# EAGLE design Digital Output Board (EAGLE 7.6.0)
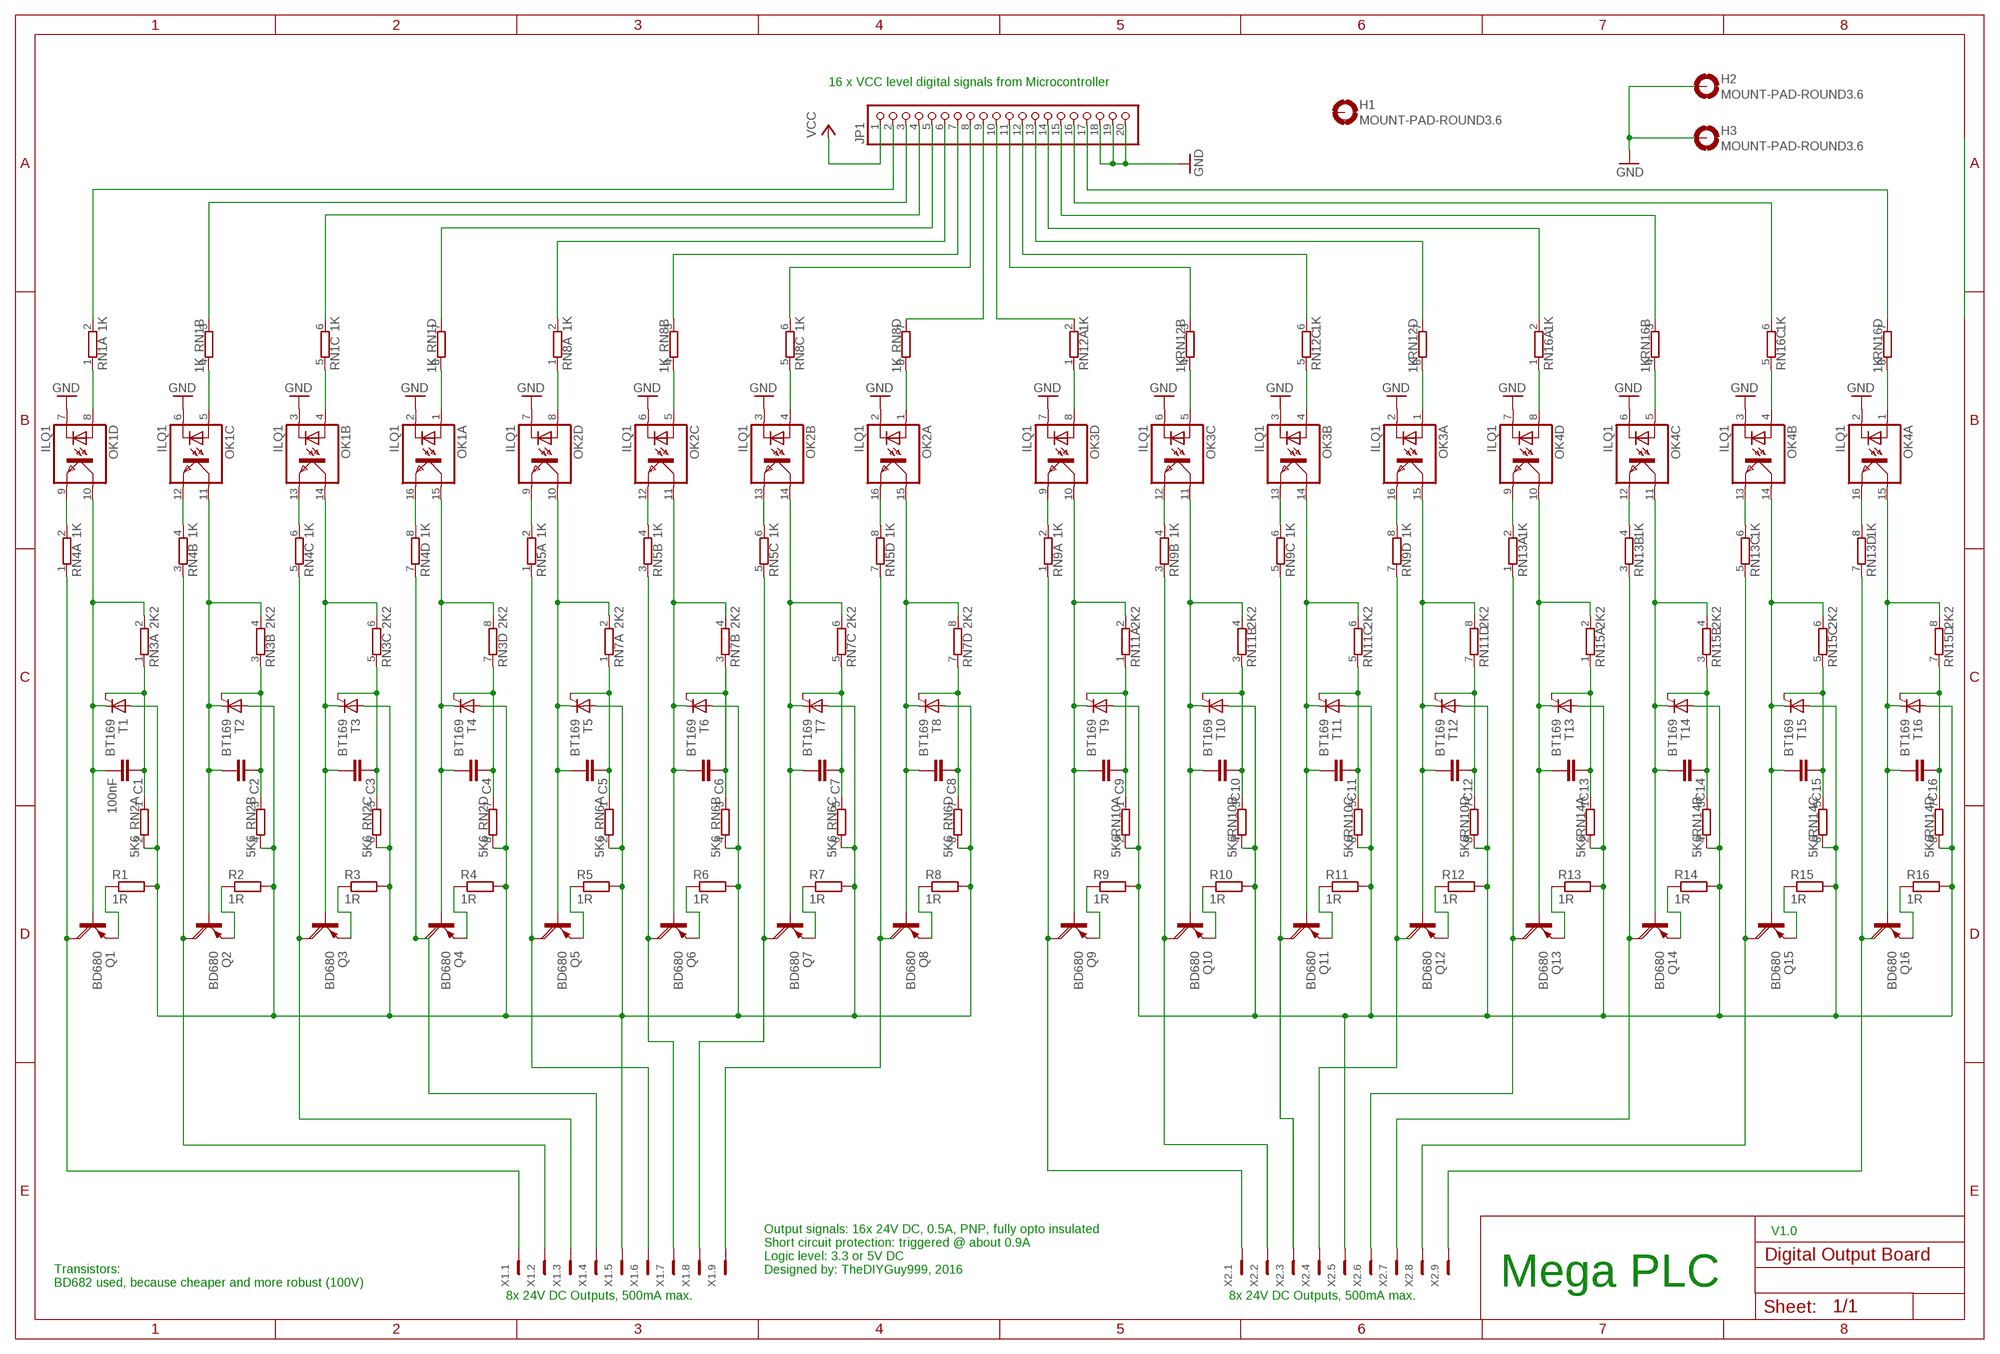
[diagram p0: schematic, sheet 1]

## Parts
C1  100nF  C-EU025-024X044  [C025-024X044]
C2  C-EU025-024X044  [C025-024X044]
C3  C-EU025-024X044  [C025-024X044]
C4  C-EU025-024X044  [C025-024X044]
C5  C-EU025-024X044  [C025-024X044]
C6  C-EU025-024X044  [C025-024X044]
C7  C-EU025-024X044  [C025-024X044]
C8  C-EU025-024X044  [C025-024X044]
C9  C-EU025-024X044  [C025-024X044]
C10  C-EU025-024X044  [C025-024X044]
C11  C-EU025-024X044  [C025-024X044]
C12  C-EU025-024X044  [C025-024X044]
C13  C-EU025-024X044  [C025-024X044]
C14  C-EU025-024X044  [C025-024X044]
C15  C-EU025-024X044  [C025-024X044]
C16  C-EU025-024X044  [C025-024X044]
H1  MOUNT-PAD-ROUND3.6  [3,6-PAD]
H2  MOUNT-PAD-ROUND3.6  [3,6-PAD]
H3  MOUNT-PAD-ROUND3.6  [3,6-PAD]
JP1  PINHD-1X20/90  [1X20/90]
OK1  ILQ1  [DIL16]
OK2  ILQ1  [DIL16]
OK3  ILQ1  [DIL16]
OK4  ILQ1  [DIL16]
Q1  BD680  [TO126AV]
Q2  BD680  [TO126AV]
Q3  BD680  [TO126AV]
Q4  BD680  [TO126AV]
Q5  BD680  [TO126AV]
Q6  BD680  [TO126AV]
Q7  BD680  [TO126AV]
Q8  BD680  [TO126AV]
Q9  BD680  [TO126AV]
Q10  BD680  [TO126AV]
Q11  BD680  [TO126AV]
Q12  BD680  [TO126AV]
Q13  BD680  [TO126AV]
Q14  BD680  [TO126AV]
Q15  BD680  [TO126AV]
Q16  BD680  [TO126AV]
R1  1R  R-EU_0207/10  [0207/10]
R2  1R  R-EU_0207/10  [0207/10]
R3  1R  R-EU_0207/10  [0207/10]
R4  1R  R-EU_0207/10  [0207/10]
R5  1R  R-EU_0207/10  [0207/10]
R6  1R  R-EU_0207/10  [0207/10]
R7  1R  R-EU_0207/10  [0207/10]
R8  1R  R-EU_0207/10  [0207/10]
R9  1R  R-EU_0207/10  [0207/10]
R10  1R  R-EU_0207/10  [0207/10]
R11  1R  R-EU_0207/10  [0207/10]
R12  1R  R-EU_0207/10  [0207/10]
R13  1R  R-EU_0207/10  [0207/10]
R14  1R  R-EU_0207/10  [0207/10]
R15  1R  R-EU_0207/10  [0207/10]
R16  1R  R-EU_0207/10  [0207/10]
RN1  1K  E4R  [SIL8]
RN2  5K6  E4R  [SIL8]
RN3  2K2  E4R  [SIL8]
RN4  1K  E4R  [SIL8]
RN5  1K  E4R  [SIL8]
RN6  5K6  E4R  [SIL8]
RN7  2K2  E4R  [SIL8]
RN8  1K  E4R  [SIL8]
RN9  1K  E4R  [SIL8]
RN10  5K6  E4R  [SIL8]
RN11  2K2  E4R  [SIL8]
RN12  1K  E4R  [SIL8]
RN13  1K  E4R  [SIL8]
RN14  5K6  E4R  [SIL8]
RN15  2K2  E4R  [SIL8]
RN16  1K  E4R  [SIL8]
T1  BT169  [TO92-2]
T2  BT169  [TO92-2]
T3  BT169  [TO92-2]
T4  BT169  [TO92-2]
T5  BT169  [TO92-2]
T6  BT169  [TO92-2]
T7  BT169  [TO92-2]
T8  BT169  [TO92-2]
T9  BT169  [TO92-2]
T10  BT169  [TO92-2]
T11  BT169  [TO92-2]
T12  BT169  [TO92-2]
T13  BT169  [TO92-2]
T14  BT169  [TO92-2]
T15  BT169  [TO92-2]
T16  BT169  [TO92-2]
X1  MC9  [MC9]
X2  MC9  [MC9]

## Nets
C+1 [24V]: R1.2 R2.2 R3.2 R4.2 R5.2 R6.2 R7.2 R8.2 RN2.2 RN2.4 RN2.6 RN2.8 RN6.2 RN6.4 RN6.6 RN6.8 T1.A T2.A T3.A T4.A T5.A T6.A T7.A T8.A X1.5
C+2 [24V]: R9.2 R10.2 R11.2 R12.2 R13.2 R14.2 R15.2 R16.2 RN10.2 RN10.4 RN10.6 RN10.8 RN14.2 RN14.4 RN14.6 RN14.8 T9.A T10.A T11.A T12.A T13.A T14.A T15.A T16.A X2.5
GND: H2.B3,6(MOUNT) H3.B3,6(MOUNT) JP1.18 JP1.19 JP1.20 OK1.2(A:C) OK1.3(B:C) OK1.6(C:C) OK1.7(D:C) OK2.2(A:C) OK2.3(B:C) OK2.6(C:C) OK2.7(D:C) OK3.2(A:C) OK3.3(B:C) OK3.6(C:C) OK3.7(D:C) OK4.2(A:C) OK4.3(B:C) OK4.6(C:C) OK4.7(D:C)
N$1: Q1.E R1.1
N$2: OK1.8(D:A) RN1.1
N$3: OK1.5(C:A) RN1.4
N$4: OK1.4(B:A) RN1.5
N$5: OK1.1(A:A) RN1.8
N$6: JP1.2 RN1.2
N$7: JP1.3 RN1.3
N$8: JP1.4 RN1.6
N$9: JP1.5 RN1.7
N$10: OK1.9(D:EMIT) RN4.2
N$11: OK1.12(C:EMIT) RN4.4
N$12: OK1.13(B:EMIT) RN4.6
N$13: OK1.16(A:EMIT) RN4.8
N$14: C1.2 OK1.10(D:COL) Q1.B RN3.2 T1.C
N$15: C1.1 RN2.1 RN3.1 T1.G
N$16: Q1.C RN4.1 X1.1
N$17: Q2.C RN4.3 X1.2
N$18: Q3.C RN4.5 X1.3
N$19: Q4.C RN4.7 X1.4
N$20: C2.2 OK1.11(C:COL) Q2.B RN3.4 T2.C
N$21: C3.2 OK1.14(B:COL) Q3.B RN3.6 T3.C
N$22: C4.2 OK1.15(A:COL) Q4.B RN3.8 T4.C
N$23: Q2.E R2.1
N$24: Q3.E R3.1
N$25: Q4.E R4.1
N$26: C2.1 RN2.3 RN3.3 T2.G
N$27: C3.1 RN2.5 RN3.5 T3.G
N$28: C4.1 RN2.7 RN3.7 T4.G
N$29: JP1.6 RN8.2
N$30: JP1.7 RN8.3
N$31: JP1.8 RN8.6
N$32: JP1.9 RN8.7
N$33: OK2.8(D:A) RN8.1
N$34: OK2.4(B:A) RN8.5
N$35: OK2.5(C:A) RN8.4
N$36: OK2.1(A:A) RN8.8
N$37: OK2.9(D:EMIT) RN5.2
N$38: OK2.12(C:EMIT) RN5.4
N$39: OK2.13(B:EMIT) RN5.6
N$40: OK2.16(A:EMIT) RN5.8
N$41: C5.1 RN6.1 RN7.1 T5.G
N$42: Q5.E R5.1
N$43: C5.2 OK2.10(D:COL) Q5.B RN7.2 T5.C
N$44: Q5.C RN5.1 X1.6
N$45: Q6.C RN5.3 X1.7
N$46: Q7.C RN5.5 X1.8
N$47: Q8.C RN5.7 X1.9
N$48: C6.2 OK2.11(C:COL) Q6.B RN7.4 T6.C
N$49: C7.2 OK2.14(B:COL) Q7.B RN7.6 T7.C
N$50: C8.2 OK2.15(A:COL) Q8.B RN7.8 T8.C
N$51: Q6.E R6.1
N$52: Q7.E R7.1
N$53: Q8.E R8.1
N$54: C6.1 RN6.3 RN7.3 T6.G
N$55: C7.1 RN6.5 RN7.5 T7.G
N$56: C8.1 RN6.7 RN7.7 T8.G
N$61: OK3.8(D:A) RN12.1
N$62: OK3.4(B:A) RN12.5
N$63: OK3.5(C:A) RN12.4
N$64: OK3.1(A:A) RN12.8
N$65: OK3.9(D:EMIT) RN9.2
N$66: OK3.12(C:EMIT) RN9.4
N$67: OK3.13(B:EMIT) RN9.6
N$68: OK3.16(A:EMIT) RN9.8
N$69: C9.1 RN10.1 RN11.1 T9.G
N$70: Q9.E R9.1
N$71: C9.2 OK3.10(D:COL) Q9.B RN11.2 T9.C
N$72: Q9.C RN9.1 X2.1
N$73: Q10.C RN9.3 X2.2
N$74: Q11.C RN9.5 X2.3
N$75: Q12.C RN9.7 X2.4
N$76: C10.2 OK3.11(C:COL) Q10.B RN11.4 T10.C
N$77: C11.2 OK3.14(B:COL) Q11.B RN11.6 T11.C
N$78: C12.2 OK3.15(A:COL) Q12.B RN11.8 T12.C
N$79: Q10.E R10.1
N$80: Q11.E R11.1
N$81: Q12.E R12.1
N$82: C10.1 RN10.3 RN11.3 T10.G
N$83: C11.1 RN10.5 RN11.5 T11.G
N$84: C12.1 RN10.7 RN11.7 T12.G
N$85: OK4.8(D:A) RN16.1
N$86: OK4.4(B:A) RN16.5
N$87: OK4.5(C:A) RN16.4
N$88: OK4.1(A:A) RN16.8
N$89: OK4.9(D:EMIT) RN13.2
N$90: OK4.12(C:EMIT) RN13.4
N$91: OK4.13(B:EMIT) RN13.6
N$92: OK4.16(A:EMIT) RN13.8
N$93: C13.1 RN14.1 RN15.1 T13.G
N$94: Q13.E R13.1
N$95: C13.2 OK4.10(D:COL) Q13.B RN15.2 T13.C
N$96: Q13.C RN13.1 X2.6
N$97: Q14.C RN13.3 X2.7
N$98: Q15.C RN13.5 X2.8
N$99: Q16.C RN13.7 X2.9
N$100: C14.2 OK4.11(C:COL) Q14.B RN15.4 T14.C
N$101: C15.2 OK4.14(B:COL) Q15.B RN15.6 T15.C
N$102: C16.2 OK4.15(A:COL) Q16.B RN15.8 T16.C
N$103: Q14.E R14.1
N$104: Q15.E R15.1
N$105: Q16.E R16.1
N$106: C14.1 RN14.3 RN15.3 T14.G
N$107: C15.1 RN14.5 RN15.5 T15.G
N$108: C16.1 RN14.7 RN15.7 T16.G
N$109: JP1.10 RN12.2
N$110: JP1.17 RN16.7
N$111: JP1.16 RN16.6
N$113: JP1.15 RN16.3
N$114: JP1.14 RN16.2
N$115: JP1.13 RN12.7
N$116: JP1.12 RN12.6
N$117: JP1.11 RN12.3
VCC: JP1.1
Unconnected: H1.B3,6(MOUNT)

## Notes on the sheet
- 16 x VCC level digital signals from Microcontroller
- V1.0
- Output signals: 16x 24V DC, 0.5A, PNP, fully opto insulated
  Short circuit protection: triggered @ about 0.9A
  Logic level: 3.3 or 5V DC
  Designed by: TheDIYGuy999, 2016
- Transistors:
  BD682 used, because cheaper and more robust (100V)
- Mega PLC
- 8x 24V DC Outputs, 500mA max. | 8x 24V DC Outputs, 500mA max.

## Library data of the parts
C1-C16 = rcl:C-EU: CAPACITOR, European symbol
H1-H3 = holes:MOUNT-PAD-ROUND: MOUNTING PAD, round
JP1 = pinhead:PINHD-1X20: PIN HEADER
OK1-OK4 = optocoupler:ILQ1: SIEMENS OPTO COUPLER; MF: VISHAY/TELEFUNKEN; MPN: ILQ1; OC_FARNELL: 1469501; OC_NEWARK: 88K1954
Q1-Q16 = 00_transistor-power:BD680: PNP DARLINGTON TRANSISTOR
R1-R16 = rcl:R-EU_: RESISTOR, European symbol
RN1-RN16 = resistor-sil:E4R: SIL RESISTOR; OC_FARNELL: unknown; OC_NEWARK: unknown
T1-T16 = triac:BT169: THYRISTOR
X1 X2 = 00_con-phoenix-381_l:MC9: Mini-Combicon 3.81mm horizontal 9-polig MC 1,5/9-G-3,81 Artikel-Nr. 1803345

## Net classes
1 24V: clearance 0.254 mm

## Board
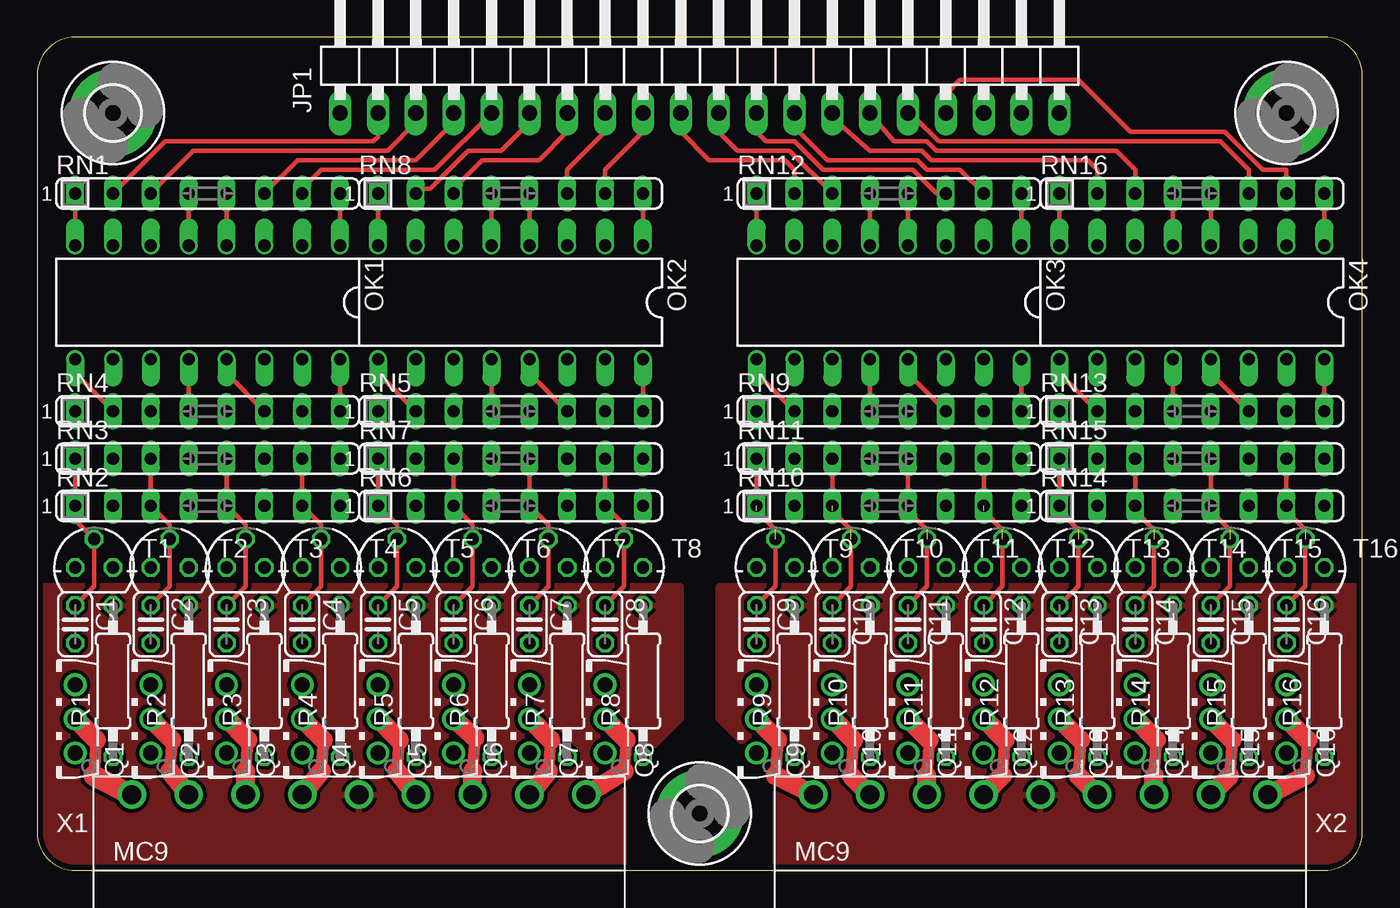
[diagram p1: board, top side]
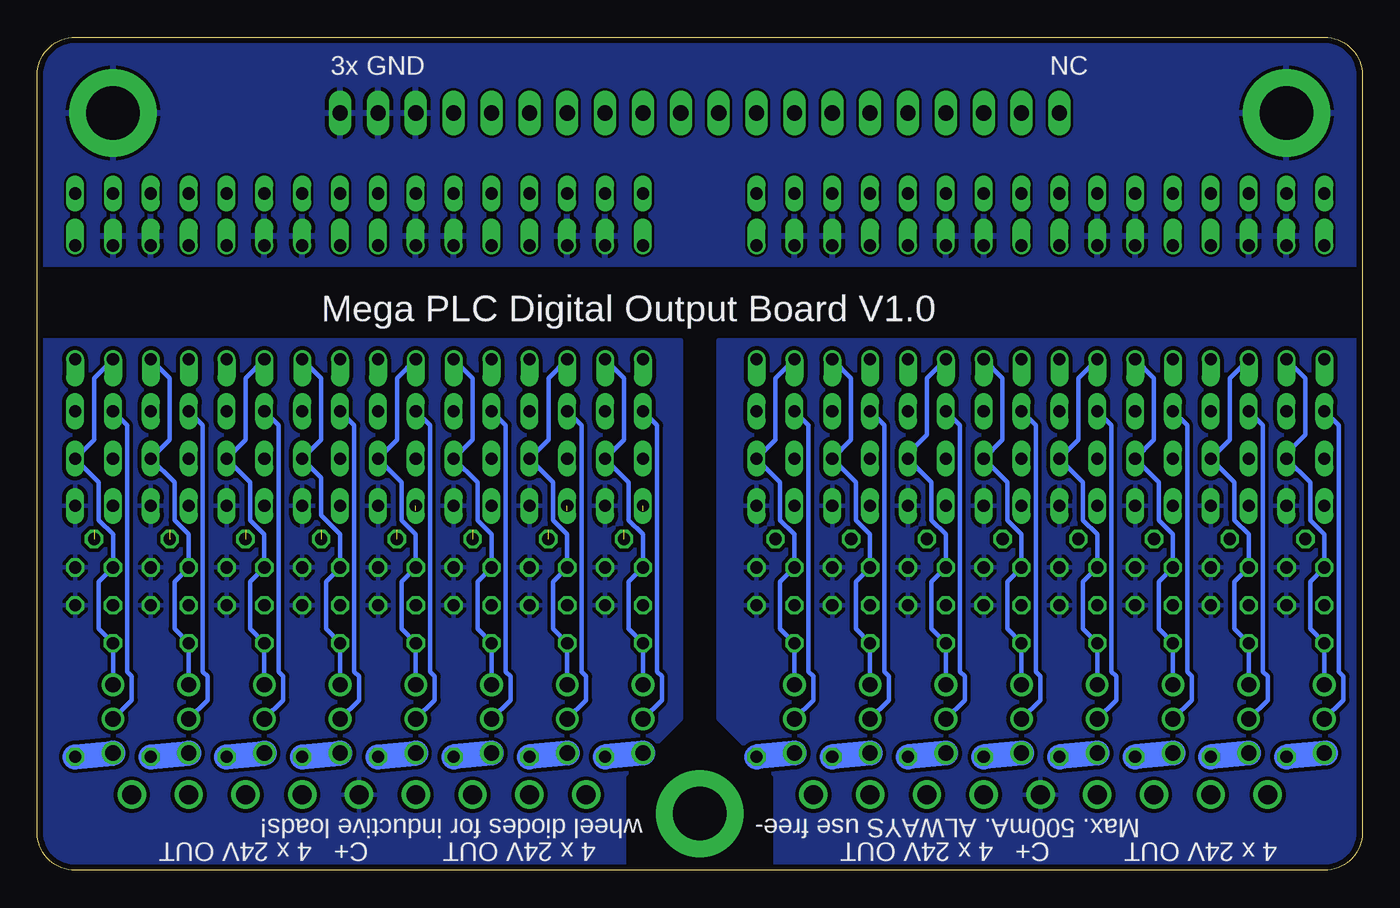
[diagram p2: board, bottom side, seen from below]

Size 88.9 x 55.88 mm. Coordinates in mm from the lower left corner, seen from the top.
Outline: 0,53.34 0,2.54 arc90 2.54,0 86.36,0 arc90 88.9,2.54 88.9,53.34 arc90 86.36,55.88 2.54,55.88 arc90 0,53.34
Copper layers (1*16): Top 0.0356mm / dielectric 1.5011mm / Bottom 0.0356mm
Design rules "OSHPark_LaenPCBOrder": minimum track width 6mil, minimum drill 13mil, track to track 6mil, track to pad 6mil, pad to pad 6mil, via to via 6mil, smd to smd 6mil, copper to edge 15mil, drill to drill 6mil, minimum pad ring 7mil, minimum via ring 7mil, stop-mask expansion 3mil, vias tented up to drill 0mil, thermal gap 10mil

### Footprints (pad centres in the part's own frame; a part is rotated, then mirrored left to right if it is on the bottom)
C025-024X044 = drill 0.813 octagon: 1 -1.27,0; 2 1.27,0
3,6-PAD = drill 3.6 pad 5.842: B3,6 0,0
1X20/90 = drill 1.016 long: 1 -24.13,-3.81; 2 -21.59,-3.81; 3 -19.05,-3.81; 4 -16.51,-3.81; 5 -13.97,-3.81; 6 -11.43,-3.81; 7 -8.89,-3.81; 8 -6.35,-3.81; 9 -3.81,-3.81; 10 -1.27,-3.81; 11 1.27,-3.81; 12 3.81,-3.81; 13 6.35,-3.81; 14 8.89,-3.81; 15 11.43,-3.81; 16 13.97,-3.81; 17 16.51,-3.81; 18 19.05,-3.81; 19 21.59,-3.81; 20 24.13,-3.81
DIL16 = drill 0.813 offset: 1 -8.89,-3.81; 2 -6.35,-3.81; 3 -3.81,-3.81; 4 -1.27,-3.81; 5 1.27,-3.81; 6 3.81,-3.81; 7 6.35,-3.81; 8 8.89,-3.81; 9 8.89,3.81; 10 6.35,3.81; 11 3.81,3.81; 12 1.27,3.81; 13 -1.27,3.81; 14 -3.81,3.81; 15 -6.35,3.81; 16 -8.89,3.81
TO126AV = drill 1.016: B 2.286,-1.27; C 0,-1.27; E -2.286,-1.27
0207/10 = drill 0.813 octagon: 1 -5.08,0; 2 5.08,0
SIL8 = drill 0.813 long: 1 -8.89,0; 2 -6.35,0; 3 -3.81,0; 4 -1.27,0; 5 1.27,0; 6 3.81,0; 7 6.35,0; 8 8.89,0
TO92-2 = drill 0.813 octagon: A 1.27,0; C -1.27,0; G 0,1.905
MC9 = drill 1.27: 1 -15.24,0; 2 -11.43,0; 3 -7.62,0; 4 -3.81,0; 5 0,0; 6 3.81,0; 7 7.62,0; 8 11.43,0; 9 15.24,0

### Placement (x,y rotation side)
C1  2.54,16.51 270 top
C2  7.62,16.51 270 top
C3  12.7,16.51 270 top
C4  17.78,16.51 270 top
C5  22.86,16.51 270 top
C6  27.94,16.51 270 top
C7  33.02,16.51 270 top
C8  38.1,16.51 270 top
C9  48.26,16.51 270 top
C10  53.34,16.51 270 top
C11  58.42,16.51 270 top
C12  63.5,16.51 270 top
C13  68.58,16.51 270 top
C14  73.66,16.51 270 top
C15  78.74,16.51 270 top
C16  83.82,16.51 270 top
H1  44.45,3.81 0 top
H2  5.08,50.8 0 top
H3  83.82,50.8 0 top
JP1  44.45,54.61 0 top
OK1  11.43,38.1 180 top
OK2  31.75,38.1 180 top
OK3  57.15,38.1 180 top
OK4  77.47,38.1 180 top
Q1  1.27,10.16 90 top
Q2  6.35,10.16 90 top
Q3  11.43,10.16 90 top
Q4  16.51,10.16 90 top
Q5  21.59,10.16 90 top
Q6  26.67,10.16 90 top
Q7  31.75,10.16 90 top
Q8  36.83,10.16 90 top
Q9  46.99,10.16 90 top
Q10  52.07,10.16 90 top
Q11  57.15,10.16 90 top
Q12  62.23,10.16 90 top
Q13  67.31,10.16 90 top
Q14  72.39,10.16 90 top
Q15  77.47,10.16 90 top
Q16  82.55,10.16 90 top
R1  5.08,12.7 90 top
R2  10.16,12.7 90 top
R3  15.24,12.7 90 top
R4  20.32,12.7 90 top
R5  25.4,12.7 90 top
R6  30.48,12.7 90 top
R7  35.56,12.7 90 top
R8  40.64,12.7 90 top
R9  50.8,12.7 90 top
R10  55.88,12.7 90 top
R11  60.96,12.7 90 top
R12  66.04,12.7 90 top
R13  71.12,12.7 90 top
R14  76.2,12.7 90 top
R15  81.28,12.7 90 top
R16  86.36,12.7 90 top
RN1  11.43,45.4 0 top
RN2  11.43,24.45 0 top
RN3  11.43,27.62 0 top
RN4  11.43,30.8 0 top
RN5  31.75,30.8 0 top
RN6  31.75,24.45 0 top
RN7  31.75,27.62 0 top
RN8  31.75,45.4 0 top
RN9  57.15,30.8 0 top
RN10  57.15,24.45 0 top
RN11  57.15,27.62 0 top
RN12  57.15,45.4 0 top
RN13  77.47,30.8 0 top
RN14  77.47,24.45 0 top
RN15  77.47,27.62 0 top
RN16  77.47,45.4 0 top
T1  3.81,20.32 0 top
T2  8.89,20.32 0 top
T3  13.97,20.32 0 top
T4  19.05,20.32 0 top
T5  24.13,20.32 0 top
T6  29.21,20.32 0 top
T7  34.29,20.32 0 top
T8  39.37,20.32 0 top
T9  49.53,20.32 0 top
T10  54.61,20.32 0 top
T11  59.69,20.32 0 top
T12  64.77,20.32 0 top
T13  69.85,20.32 0 top
T14  74.93,20.32 0 top
T15  80.01,20.32 0 top
T16  85.09,20.32 0 top
X1  21.59,5.08 0 top
X2  67.31,5.08 0 top

### Tracks (layer width: path | path; a pad name or v marks a point on that pad's centre or on a via)
C+1
  pour Bottom: -1.27,35.56 43.18,35.56 43.18,10.16 39.37,6.35 39.37,-1.27 -1.27,-1.27
  pour Top: -1.27,-1.27 39.37,-1.27 39.37,6.35 43.18,10.16 43.18,19.05 -1.27,19.05
C+2
  pour Bottom: 45.72,35.56 90.17,35.56 90.17,-1.27 49.53,-1.27 49.53,6.35 45.72,10.16
  pour Top: 45.72,19.05 45.72,10.16 49.53,6.35 49.53,-1.27 90.17,-1.27 90.17,19.05
GND
  pour Bottom: -1.27,57.15 -1.27,40.64 90.17,40.64 90.17,57.15
N$1
  Bottom 1.422: Q1.E 2.48,7.87
  Bottom 1.676: 2.48,7.87 R1.1
N$2
  Top 0.305: OK1.8 RN1.1
N$3
  Top 0.305: OK1.5 RN1.4
N$4
  Top 0.305: OK1.4 RN1.5
N$5
  Top 0.305: OK1.1 RN1.8
N$6
  Top 0.305: JP1.2 22.86,49.21 22.54,48.9 8.57,48.9 RN1.2
N$7
  Top 0.305: JP1.3 25.4,50.16 23.5,48.26 10.48,48.26 RN1.3
N$8
  Top 0.305: JP1.4 27.94,50.16 25.4,47.62 17.46,47.62 RN1.6
N$9
  Top 0.305: RN1.7 17.78,45.72 19.05,46.99 26.67,46.99 JP1.5
N$10
  Top 0.305: OK1.9 2.54,33.34 RN4.2
N$11
  Top 0.305: RN4.4 OK1.12
N$12
  Top 0.305: OK1.13 12.7,33.34 RN4.6
N$13
  Top 0.305: RN4.8 OK1.16
N$14
  Bottom 0.305: Q1.B C1.2 3.49,16.19 3.49,19.37 T1.C 2.54,22.54 3.49,23.5 3.49,26.04 RN3.2 5.08,27.94 3.81,29.21 3.81,33.02 OK1.10
N$15
  Top 0.305: C1.1 3.81,19.05 T1.G 2.54,23.5 RN2.1 RN3.1
N$16
  Top 0.762: 3.97,8.73 3.81,6.35
  Top 1.27: Q1.C 3.97,8.73
  Top 1.422: 3.81,6.35 X1.1
  Bottom 0.305: Q1.C 1.27,11.43 1.27,13.02 1.59,13.34 1.59,29.84 RN4.1
N$17
  Top 0.762: 9.05,8.73 8.89,6.67
  Top 1.27: Q2.C 9.05,8.73 | X1.2 8.89,6.67
  Bottom 0.305: Q2.C 6.35,11.43 6.35,13.02 6.67,13.34 6.67,29.84 RN4.3
N$18
  Top 0.762: 14.13,8.73 13.97,6.67
  Top 1.27: Q3.C 14.13,8.73 | X1.3 13.97,6.67
  Bottom 0.305: Q3.C 11.43,11.43 11.43,13.02 11.75,13.34 11.75,29.84 RN4.5
N$19
  Top 0.762: 19.21,8.73 19.05,6.67
  Top 1.27: Q4.C 19.21,8.73 | X1.4 19.05,6.67
  Bottom 0.305: Q4.C 16.51,11.43 16.51,13.02 16.83,13.34 16.83,29.84 RN4.7
N$20
  Bottom 0.305: Q2.B C2.2 8.57,16.19 8.57,19.37 T2.C 7.62,22.54 8.57,23.5 8.57,26.04 RN3.4 8.89,28.89 8.89,33.02 OK1.11
N$21
  Bottom 0.305: Q3.B C3.2 13.65,16.19 13.65,19.37 T3.C 12.7,22.54 13.65,23.5 13.65,26.04 RN3.6 13.97,28.89 13.97,33.02 OK1.14
N$22
  Bottom 0.305: Q4.B C4.2 18.73,16.19 18.73,19.37 T4.C 17.78,22.54 18.73,23.5 18.73,26.04 RN3.8 19.05,28.89 19.05,33.02 OK1.15
N$23
  Bottom 1.676: Q2.E R2.1
N$24
  Bottom 1.676: Q3.E R3.1
N$25
  Bottom 1.676: Q4.E R4.1
N$26
  Top 0.305: RN3.3 RN2.3 8.89,23.18 T2.G 8.89,19.05 C2.1
N$27
  Top 0.305: C3.1 13.97,19.05 T3.G 13.97,23.18 RN2.5 RN3.5
N$28
  Top 0.305: C4.1 19.05,19.05 T4.G 19.05,23.18 RN2.7 RN3.7
N$29
  Top 0.305: RN8.2 25.4,45.72 26.35,45.72 28.89,48.26 31.11,48.26 33.02,50.16 JP1.6
N$30
  Top 0.305: RN8.3 27.94,45.72 29.84,47.62 33.66,47.62 35.56,49.53 JP1.7
N$31
  Top 0.305: RN8.6 35.56,46.99 38.1,49.53 JP1.8
N$32
  Top 0.305: RN8.7 38.1,46.99 40.64,49.53 JP1.9
N$33
  Top 0.305: RN8.1 OK2.8
N$34
  Top 0.305: RN8.5 OK2.4
N$35
  Top 0.305: RN8.4 OK2.5
N$36
  Top 0.305: RN8.8 OK2.1
N$37
  Top 0.305: OK2.9 22.86,33.34 RN5.2
N$38
  Top 0.305: OK2.12 RN5.4
N$39
  Top 0.305: OK2.13 33.02,33.34 RN5.6
N$40
  Top 0.305: OK2.16 RN5.8
N$41
  Top 0.305: C5.1 24.13,19.05 T5.G 24.13,23.18 RN6.1 RN7.1
N$42
  Bottom 1.676: Q5.E R5.1
N$43
  Bottom 0.305: Q5.B C5.2 23.81,16.19 23.81,19.37 T5.C 22.86,22.54 23.81,23.5 23.81,26.04 RN7.2 24.13,28.89 24.13,33.02 OK2.10
N$44
  Top 0.762: 24.13,6.67 24.29,8.73
  Top 1.27: Q5.C 24.29,8.73 | X1.6 24.13,6.67
  Bottom 0.305: Q5.C 21.59,11.43 21.59,13.02 21.91,13.34 21.91,29.84 RN5.1
N$45
  Top 0.762: 29.21,6.67 29.37,8.89
  Top 1.27: Q6.C 29.37,8.89 | X1.7 29.21,6.67
  Bottom 0.305: Q6.C 26.67,11.43 26.67,13.02 26.99,13.34 26.99,29.84 RN5.3
N$46
  Top 0.762: 34.29,6.67 34.45,8.73
  Top 1.27: X1.8 34.29,6.67 | Q7.C 34.45,8.73
  Bottom 0.305: Q7.C 31.75,11.43 31.75,13.02 32.07,13.34 32.07,29.84 RN5.5
N$47
  Top 0.762: 39.37,6.67 39.53,8.73
  Top 1.27: Q8.C 39.53,8.73 | X1.9 39.37,6.67
  Bottom 0.305: Q8.C 36.83,11.43 36.83,13.02 37.15,13.34 37.15,29.84 RN5.7
N$48
  Bottom 0.305: Q6.B C6.2 28.89,16.19 28.89,19.37 T6.C 27.94,22.54 28.89,23.5 28.89,26.04 RN7.4 30.48,27.94 29.21,29.21 29.21,33.02 OK2.11
N$49
  Bottom 0.305: Q7.B C7.2 33.97,16.19 33.97,19.37 T7.C 33.02,22.54 33.97,23.5 33.97,26.04 RN7.6 34.29,28.89 34.29,33.02 OK2.14
N$50
  Bottom 0.305: Q8.B C8.2 39.05,16.19 39.05,19.37 T8.C 38.1,22.54 39.05,23.5 39.05,26.04 RN7.8 39.37,28.89 39.37,33.02 OK2.15
N$51
  Bottom 1.676: Q6.E R6.1
N$52
  Bottom 1.676: Q7.E R7.1
N$53
  Bottom 1.676: Q8.E R8.1
N$54
  Top 0.305: C6.1 29.21,19.05 T6.G 29.21,23.18 RN6.3 RN7.3
N$55
  Top 0.305: C7.1 34.29,19.05 T7.G 34.29,23.18 RN6.5 RN7.5
N$56
  Top 0.305: C8.1 39.37,19.05 T8.G 39.37,23.18 RN6.7 RN7.7
N$61
  Top 0.305: RN12.1 OK3.8
N$62
  Top 0.305: RN12.5 OK3.4
N$63
  Top 0.305: RN12.4 OK3.5
N$64
  Top 0.305: RN12.8 OK3.1
N$65
  Top 0.305: OK3.9 48.26,33.34 RN9.2
N$66
  Top 0.305: OK3.12 RN9.4
N$67
  Top 0.305: OK3.13 58.42,33.34 RN9.6
N$68
  Top 0.305: OK3.16 RN9.8
N$69  (2 unrouted)
  Top 0.305: RN11.1 48.26,24.13 49.53,22.86 49.53,19.05 C9.1
N$70
  Bottom 1.676: Q9.E R9.1
N$71
  Bottom 0.305: Q9.B C9.2 49.21,16.19 49.21,19.37 T9.C 48.26,22.54 49.21,23.5 49.21,26.04 RN11.2 49.53,28.89 49.53,33.02 OK3.10
N$72
  Top 0.762: 49.69,8.73 49.53,6.35
  Top 1.27: X2.1 49.53,6.35 | Q9.C 49.69,8.73
  Bottom 0.305: Q9.C 46.99,11.43 46.99,13.02 47.31,13.34 47.31,29.84 RN9.1
N$73
  Top 0.762: 54.77,8.73 54.61,6.35
  Top 1.27: X2.2 54.61,6.35 | Q10.C 54.77,8.73
  Bottom 0.305: Q10.C 52.07,11.43 52.07,13.02 52.39,13.34 52.39,29.84 RN9.3
N$74
  Top 0.762: 59.85,8.73 59.69,6.35
  Top 1.27: X2.3 59.69,6.35 | Q11.C 59.85,8.73
  Bottom 0.305: Q11.C 57.15,11.43 57.15,13.02 57.47,13.34 57.47,29.84 RN9.5
N$75
  Top 0.762: 64.93,8.73 64.77,6.35
  Top 1.27: X2.4 64.77,6.35 | Q12.C 64.93,8.73
  Bottom 0.305: Q12.C 62.23,11.43 62.23,13.02 62.55,13.34 62.55,29.84 RN9.7
N$76
  Bottom 0.305: OK3.11 54.61,33.02 54.61,28.89 RN11.4 55.56,27.3 54.29,26.04 54.29,23.5 53.34,22.54 T10.C 54.29,19.37 54.29,16.19 C10.2 Q10.B
N$77
  Bottom 0.305: OK3.14 59.69,33.02 59.69,28.89 RN11.6 59.37,26.04 59.37,23.5 58.42,22.54 T11.C 59.37,19.37 59.37,16.19 C11.2 Q11.B
N$78
  Bottom 0.305: OK3.15 64.77,33.02 64.77,28.89 RN11.8 65.72,27.3 64.45,26.04 64.45,23.5 63.5,22.54 T12.C 64.45,19.37 64.45,16.19 C12.2 Q12.B
N$79
  Bottom 1.676: Q10.E R10.1
N$80
  Bottom 1.676: Q11.E R11.1
N$81
  Bottom 1.676: R12.1 Q12.E
N$82  (2 unrouted)
  Top 0.305: RN11.3 53.34,24.13 54.61,22.86 54.61,19.05 C10.1
N$83  (1 unrouted)
  Top 0.305: RN11.5 RN10.5 58.42,24.13 59.69,22.86 59.69,19.05 C11.1
N$84  (2 unrouted)
  Top 0.305: RN11.7 63.5,24.13 64.77,22.86 64.77,19.05 C12.1
N$85
  Top 0.305: RN16.1 OK4.8
N$86
  Top 0.305: RN16.5 OK4.4
N$87
  Top 0.305: RN16.4 OK4.5
N$88
  Top 0.305: RN16.8 OK4.1
N$89
  Top 0.305: OK4.9 68.58,33.34 RN13.2
N$90
  Top 0.305: OK4.12 RN13.4
N$91
  Top 0.305: OK4.13 78.74,33.34 RN13.6
N$92
  Top 0.305: OK4.16 RN13.8
N$93  (1 unrouted)
  Top 0.305: RN15.1 RN14.1 68.58,24.13 69.85,22.86 69.85,19.05 C13.1
N$94
  Bottom 1.676: R13.1 Q13.E
N$95
  Bottom 0.305: OK4.10 69.85,33.02 69.85,28.89 RN15.2 69.85,26.35 69.85,23.81 68.58,22.54 T13.C 69.53,19.37 69.53,16.19 C13.2 Q13.B
N$96
  Top 0.762: 70.01,8.73 69.85,6.35
  Top 1.27: X2.6 69.85,6.35 | Q13.C 70.01,8.73
  Bottom 0.305: Q13.C 67.31,11.43 67.31,13.02 67.63,13.34 67.63,29.84 RN13.1
N$97
  Top 0.762: 75.09,8.73 74.93,6.35
  Top 1.27: X2.7 74.93,6.35 | Q14.C 75.09,8.73
  Bottom 0.305: Q14.C 72.39,11.43 72.39,13.02 72.71,13.34 72.71,29.84 RN13.3
N$98
  Top 0.762: 80.17,8.73 80.01,6.35
  Top 1.27: X2.8 80.01,6.35 | Q15.C 80.17,8.73
  Bottom 0.305: Q15.C 77.47,11.43 77.47,13.02 77.79,13.34 77.79,29.84 RN13.5
N$99
  Top 0.762: 85.25,8.73 85.09,6.35
  Top 1.27: X2.9 85.09,6.35 | Q16.C 85.25,8.73
  Bottom 0.305: Q16.C 82.55,11.43 82.55,13.02 82.87,13.34 82.87,29.84 RN13.7
N$100
  Bottom 0.305: OK4.11 74.93,33.02 74.93,28.89 RN15.4 74.61,26.04 74.61,23.5 73.66,22.54 T14.C 74.61,19.37 74.61,16.19 C14.2 Q14.B
N$101
  Bottom 0.305: OK4.14 80.01,33.02 80.01,28.89 RN15.6 79.69,26.04 79.69,23.5 78.74,22.54 T15.C 79.69,19.37 79.69,16.19 C15.2 Q15.B
N$102
  Bottom 0.305: OK4.15 85.09,33.02 85.09,28.89 RN15.8 84.77,26.04 84.77,23.5 83.82,22.54 T16.C 84.77,19.37 84.77,16.19 C16.2 Q16.B
N$103
  Bottom 1.676: R14.1 Q14.E
N$104
  Bottom 1.676: R15.1 Q15.E
N$105
  Bottom 1.676: R16.1 Q16.E
N$106  (1 unrouted)
  Top 0.305: RN15.3 RN14.3 73.66,24.13 74.93,22.86 74.93,19.05 C14.1
N$107  (1 unrouted)
  Top 0.305: RN15.5 RN14.5 78.74,24.13 80.01,22.86 80.01,19.05 C15.1
N$108  (1 unrouted)
  Top 0.305: RN15.7 RN14.7 83.82,24.13 85.09,22.86 85.09,19.05 C16.1
N$109
  Top 0.305: JP1.10 43.18,49.53 45.09,47.62 50.16,47.62 50.8,46.99 RN12.2
N$110
  Top 0.305: JP1.17 60.96,52.07 61.91,53.02 69.85,53.02 73.34,49.53 79.69,49.53 82.23,46.99 83.82,46.99 RN16.7
N$111
  Top 0.305: RN16.6 81.28,46.99 79.38,48.9 60.48,48.9 58.9,50.48 58.74,50.48 JP1.16
N$113
  Top 0.305: JP1.15 57.47,48.9 59.69,48.9 60.33,48.26 72.39,48.26 73.66,46.99 RN16.3
N$114
  Top 0.305: JP1.14 53.34,50.48 55.88,48.26 59.37,48.26 60.01,47.62 70.48,47.62 71.12,46.99 RN16.2
N$115
  Top 0.305: JP1.13 50.8,49.85 53.02,47.62 59.05,47.62 59.69,46.99 61.91,46.99 RN12.7
N$116
  Top 0.305: JP1.12 48.26,49.53 48.9,48.9 50.8,48.9 52.7,46.99 58.74,46.99 60.33,45.4 RN12.6
N$117
  Top 0.305: JP1.11 45.72,49.53 46.99,48.26 50.48,48.26 RN12.3

### Text on the board
bNames: NC | 3x GND | Mega PLC Digital Output Board V1.0 | Max. 500mA. ALWAYS use free- wheel diodes for inductive loads! | 4 x 24V OUT | C+ | 4 x 24V OUT | 4 x 24V OUT | C+ | 4 x 24V OUT